# Altium project PowCapMobile.PrjPCB (part 3 of 3)
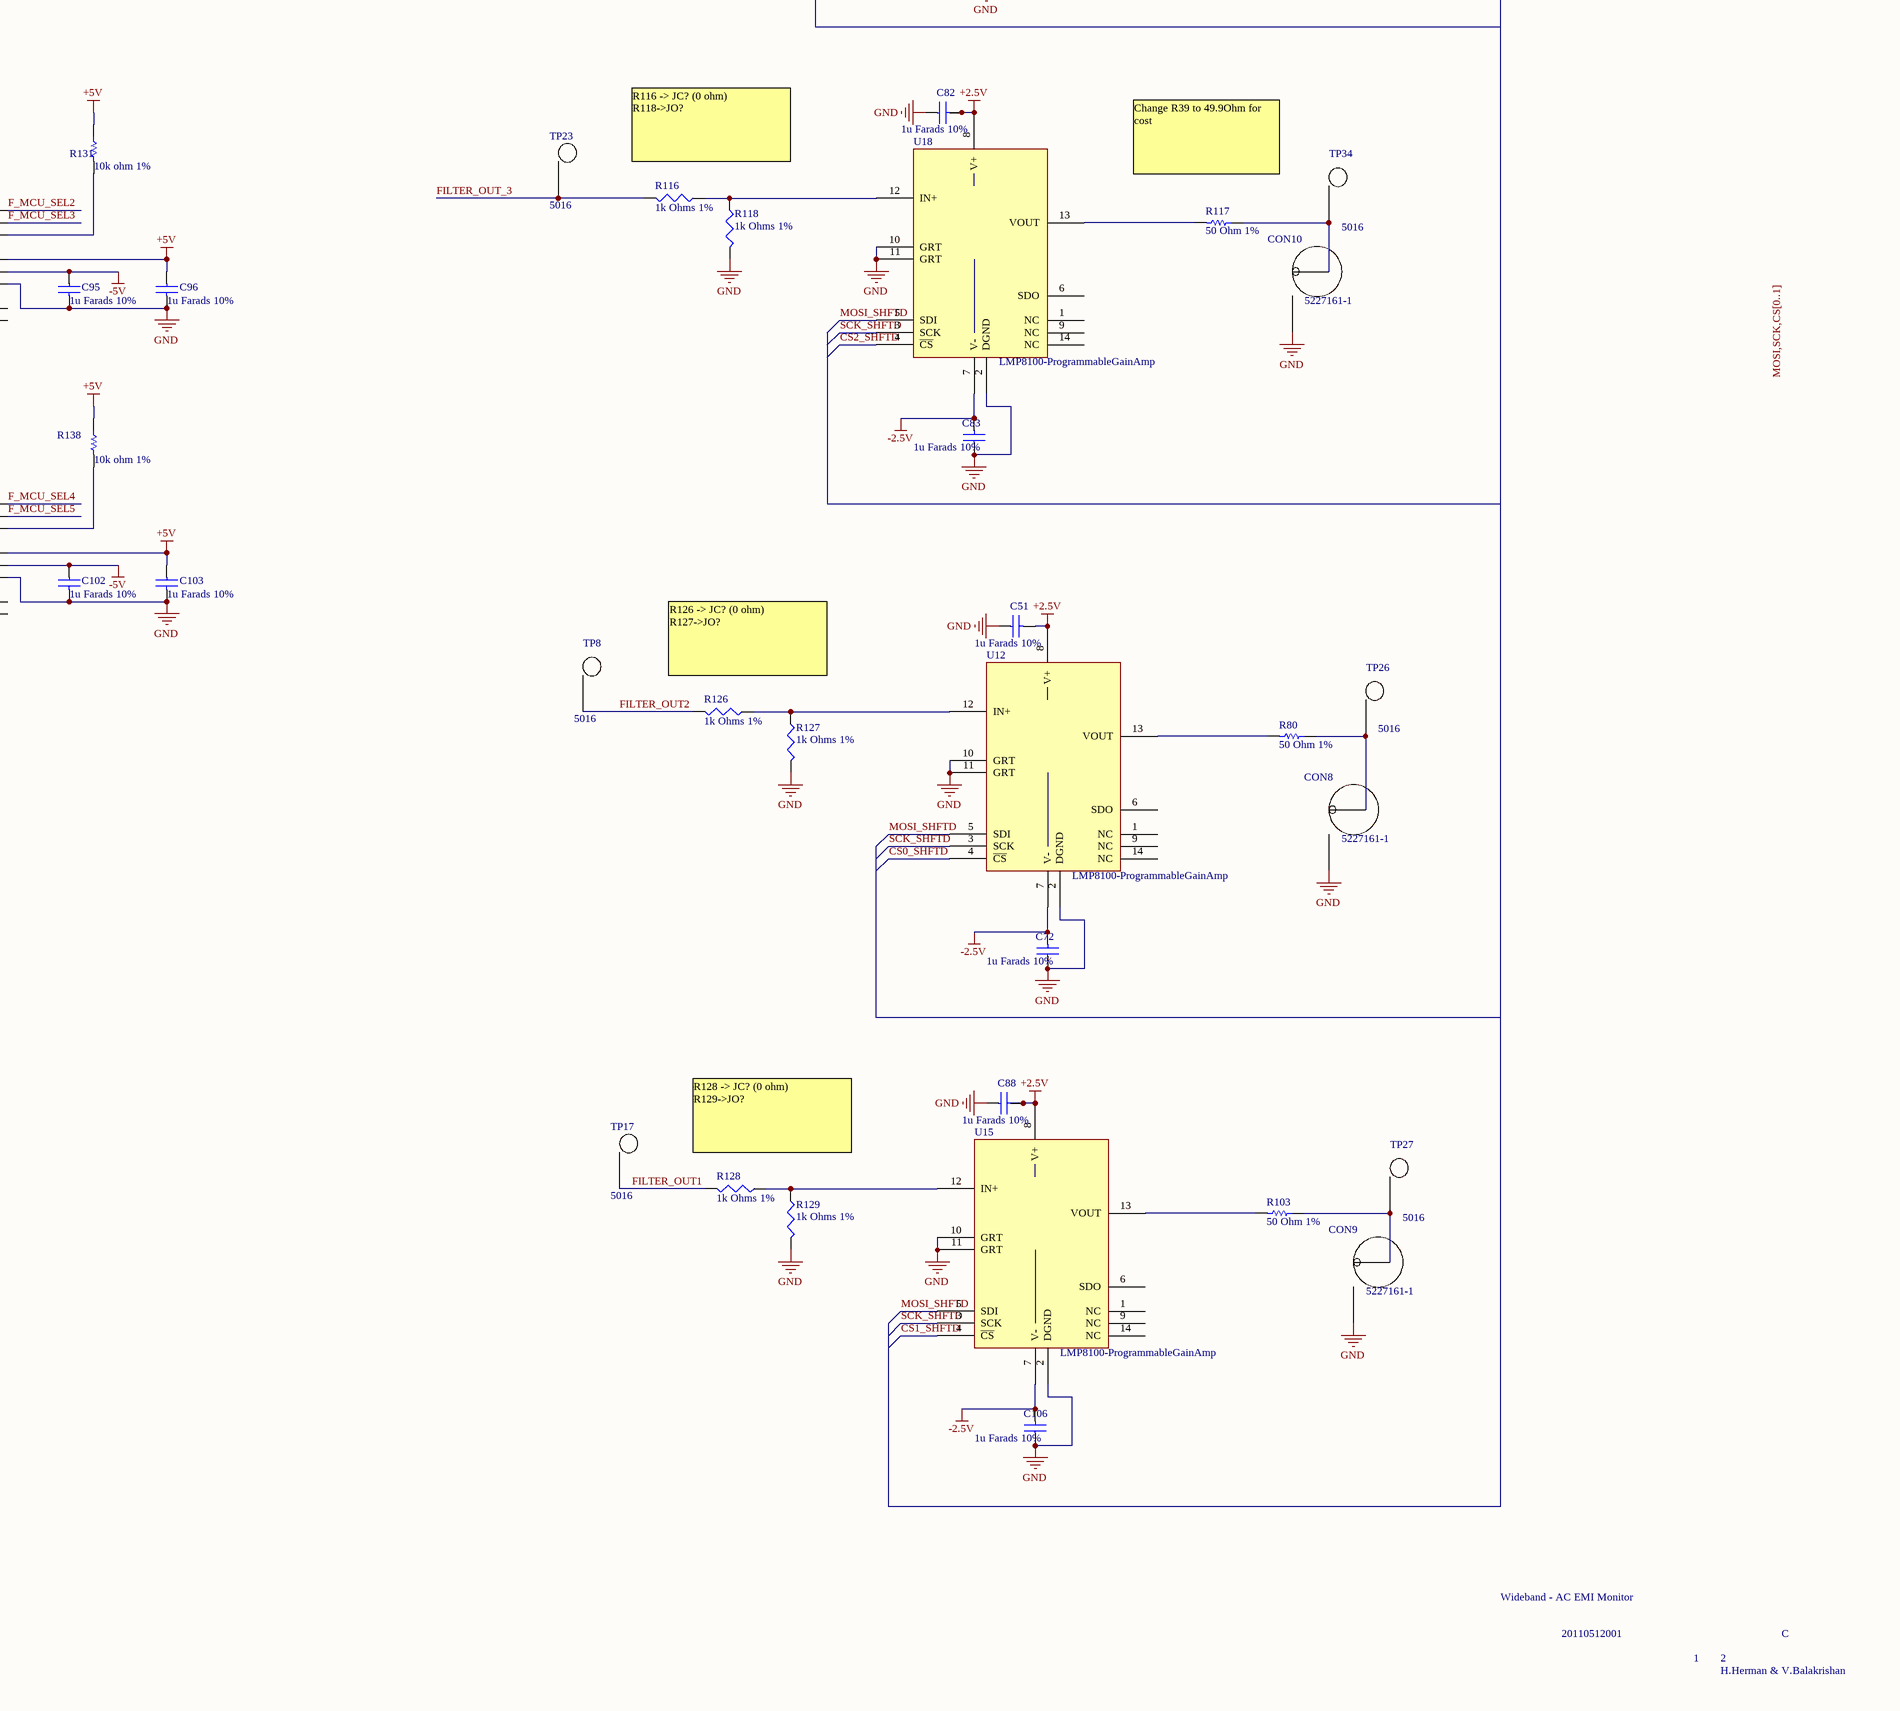
[diagram p10: PowCapMobile.SchDoc, bottom right]

## Sheet PowCapMobile.SchDoc (continued)

### Library data of the parts (continued)
U22 = 2179: schottky diode; operating temperature range:0°c to +70°c;; mfrName: Comchip; Extra_Description: BRIDGE RECTIFIER 600V 2A DFS / 4 pin; Obsolete: False; Temp_Max: 0; TypeNotes: Applies to all parts in the database; PartID: 2179; mfrPartNum: DF206ST-G; URL_Image: http://media.digikey.com/Photos/Comchip%20Tech%20Photos/DF206ST-G_sml.jpg; URL_Datasheet: http://datasheet.octopart.com/UC3610DW-Texas-Instruments-datasheet-152804.pdf; Date_Created: 5/5/2011 3:08:22 AM; Date_LastModified: 5/5/2011 3:08:22 AM; Verified: False; RoHS: True; Temp_Min: 0; Type: All Parts
VR1 VR2 = 2181: v reg, linear, 37v, smd; voltage regulator type:adjustable; mfrName: National Semiconductor; Extra_Description: V REG, LINEAR, 37V, SMD; Voltage Regulator Type:Adjustable Positive; Voltage, Input Max:40V; Voltage, Output Max:37V; Max Output Current:1.5A; No. of Outputs:1; Voltage, Output Adjustable Max:37V; Voltage, Output Adjustable Min:1.2V; Voltage, Supply Min:3V; Voltage, Supply Max:40V; Termination Type:SMD; Case Style:SOT-223; No. of Pins:4; Operating Temperature Range:0°C to +125°C / Mounting Type: ``Surface Mount`` / Lead-Free Status: ``Contains Lead`` / Packaging: ``Cut Tape (CT)`` / RoHS: ``Compliant`` / Current Rating: { / ``uncertainty_minus``: null, / ``value``: 1.0, / ``uncertainty_plus``: null / } / Output Current: { / ``uncertainty_minus``: null, / ``value``: 1.0, / ``uncertainty_plus``: null / } / Operating Temperature: { / ``max_value``: 125.0, / ``max_uncertainty_plus``: null, / ``min_value``: null, / ``min_uncertainty_plus``: null, / ``max_uncertainty_minus``: null / } / Output Voltage: { / ``max_value``: null, / ``max_uncertainty_plus``: null, / ``min_value``: 1.2, / ``min_uncertainty_plus``: null, / ``max_uncertainty_minus``: null / } / Supply Voltage (DC): { / ``max_value``: 40.0, / ``max_uncertainty_plus``: null, / ``min_value``: null, / ``min_uncertainty_plus``: null, / ``max_uncertainty_minus``: null / } / Number of Outputs: 1 / Number of Pins: 4; Obsolete: False; Temp_Max: 0; TypeNotes: Applies to all parts in the database; PartID: 2181; mfrPartNum: LM317EMP/NOPB; URL_Image: http://cdn.sigma.octopart.com/9036263/image/National-Semiconductor-LM317EMP/NOPB.jpg; URL_Datasheet: http://datasheet.octopart.com/LM317EMP/NOPB-National-Semiconductor-datasheet-124580.pdf; Date_Created: 5/5/2011 3:47:18 AM; Date_LastModified: 5/5/2011 3:47:18 AM; Verified: False; RoHS: True; Temp_Min: 0; Type: All Parts
VR3 VR4 = 2183: linear voltage regulator ic; output voltage adjustable; mfrName: National Semiconductor; Extra_Description: Linear Voltage Regulator IC; Output Voltage Adjustable Range:-1.2V to -37V; Output Current:1A; No. of Outputs:1; No. of Pins:3; Operating Temperature Range:-40°C to +125°C; Leaded Process Compatible:Yes; Output Current Max:1.5A ;RoHS Compliant: Yes / Mounting Type: ``Surface Mount`` / Case / Package: ``SOT-223`` / Packaging: ``Cut Tape (CT)`` / Lead-Free Status: ``Lead Free`` / RoHS: ``Compliant`` / Output Current: { / ``uncertainty_minus``: null, / ``value``: 1.5, / ``uncertainty_plus``: null / } / Operating Temperature: { / ``max_value``: 150.0, / ``max_uncertainty_plus``: null, / ``min_value``: null, / ``min_uncertainty_plus``: null, / ``max_uncertainty_minus``: null / } / Number of Pins: 3; Obsolete: False; Temp_Max: 0; TypeNotes: Applies to all parts in the database; PartID: 2183; mfrPartNum: LM337IMP/NOPB; URL_Image: http://cdn.sigma.octopart.com/9036263/image/National-Semiconductor-LM337IMP/NOPB.jpg; URL_Datasheet: http://datasheet.octopart.com/LM337IMP/NOPB-National-Semiconductor-datasheet-10977.pdf; Date_Created: 5/5/2011 4:18:00 AM; Date_LastModified: 5/5/2011 4:18:00 AM; Verified: False; RoHS: True; Temp_Min: 0; Type: All Parts
X1 = 2325: crystal 16.0000 mhz 18.0pf smd; mfrName: Epson; mfrPartNum: FA-238 16.0000MB-C3; Obsolete: False; Temp_Max: 0; TypeNotes: Applies to all parts in the database; PartID: 2325; Extra_Description: CRYSTAL 16.0000 MHZ 18.0PF SMD; URL_Image: http://media.digikey.com/Photos/Epson%20Toyocom%20Photos/FA-238%20SERIES_sml.jpg; URL_Datasheet: http://www.eea.epson.com/portal/pls/portal/docs/1/1145465.PDF; Date_Created: 8/1/2011 6:48:21 AM; Date_LastModified: 8/1/2011 6:48:21 AM; Verified: False; RoHS: True; Temp_Min: 0; Type: All Parts
XFR1 = 2197: transformers 12.6vct @ 2.40a 6.3v @ 4.80a; mfrName: Tamura; Extra_Description: TRANSF LO PRO DUAL 6.3VAC 4.8A / Mounting Type: ``Through Hole`` / Lead-Free Status: ``Lead Free`` / Packaging: ``Bulk`` / RoHS: ``Compliant`` / Power Rating: { / ``uncertainty_minus``: null, / ``value``: 30.0, / ``uncertainty_plus``: null / } / Size-Length: { / ``uncertainty_minus``: null, / ``value``: 0.066675, / ``uncertainty_plus``: null / } / Size-Height: { / ``uncertainty_minus``: null, / ``value``: 0.0397, / ``uncertainty_plus``: null / } / Weight: { / ``uncertainty_minus``: null, / ``value``: 521.631, / ``uncertainty_plus``: null / } / Size-Width: { / ``uncertainty_minus``: null, / ``value``: 0.055575, / ``uncertainty_plus``: null / } / Frequency: { / ``max_value``: 60.0, / ``max_uncertainty_plus``: null, / ``min_value``: null, / ``min_uncertainty_plus``: null, / ``max_uncertainty_minus``: null / } / Output Power: { / ``max_value``: 30.0, / ``max_uncertainty_plus``: null, / ``min_value``: null, / ``min_uncertainty_plus``: null, / ``max_uncertainty_minus``: null / }; Obsolete: False; Temp_Max: 0; TypeNotes: Applies to all parts in the database; PartID: 2197; mfrPartNum: PL30-12-130B; URL_Image: http://cdn.sigma.octopart.com/9086040/image/Tamura-PL30-12-130B.jpg; URL_Datasheet: http://datasheet.octopart.com/PL30-12-130B-Tamura-datasheet-32611.pdf; Date_Created: 5/7/2011 2:03:49 AM; Date_LastModified: 5/7/2011 2:03:49 AM; Verified: False; RoHS: True; Temp_Min: 0; Type: All Parts